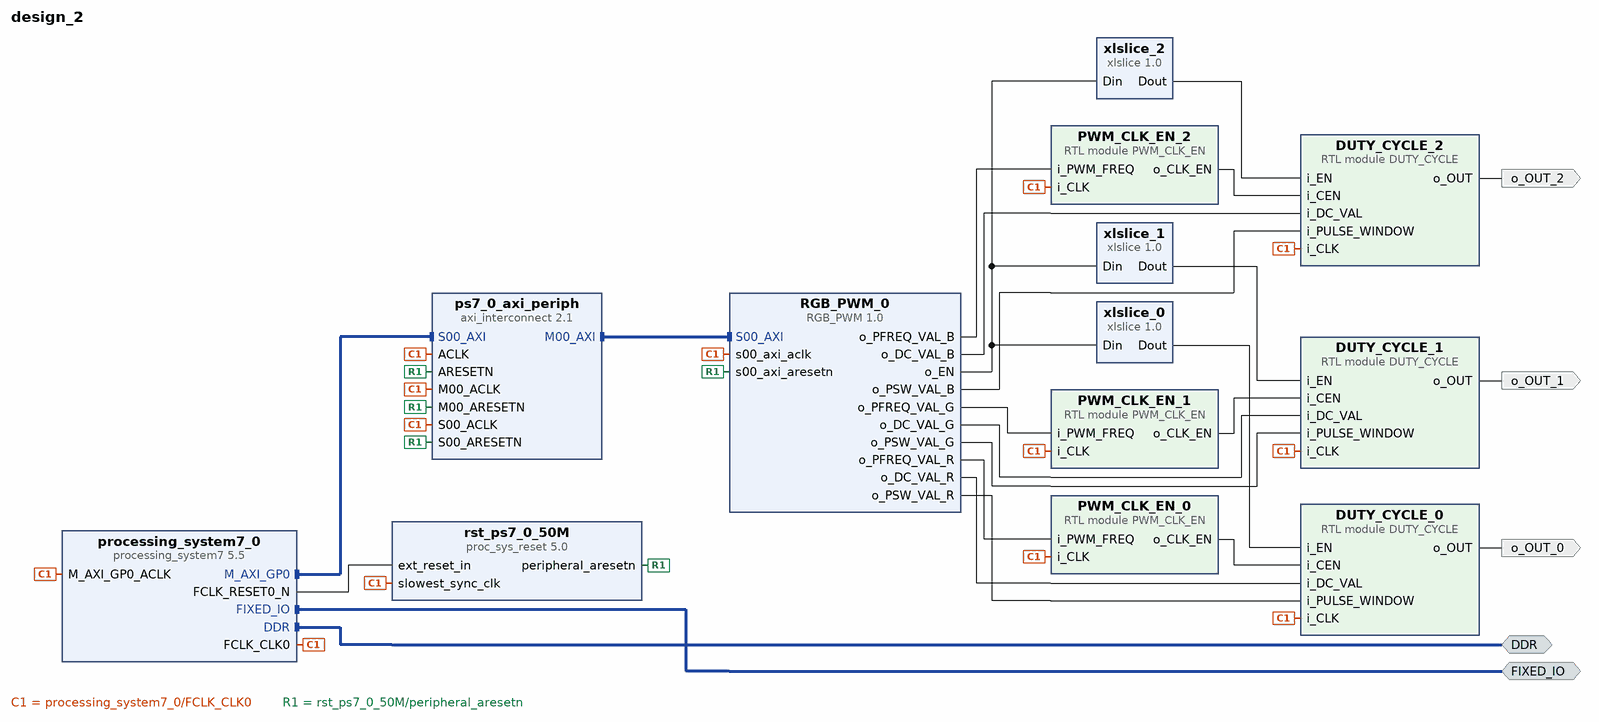
[diagram p0: block diagram of the top level]
# Vivado block design design_2, xc7z007sclg400-1, Vivado 2019.1
create_bd_design design_2

create_bd_intf_port -mode Master -vlnv xilinx.com:interface:ddrx_rtl:1.0 DDR
create_bd_intf_port -mode Master -vlnv xilinx.com:display_processing_system7:fixedio_rtl:1.0 FIXED_IO
create_bd_port -dir O o_OUT_2
create_bd_port -dir O o_OUT_0
create_bd_port -dir O o_OUT_1

create_bd_cell -type ip -vlnv xilinx.com:ip:processing_system7:5.5 processing_system7_0
set_property -dict [list \
  CONFIG.PCW_FPGA0_PERIPHERAL_FREQMHZ 50 \
  CONFIG.PCW_GPIO_MIO_GPIO_ENABLE 1 \
  CONFIG.PCW_GPIO_MIO_GPIO_IO MIO \
  CONFIG.PCW_I2C_RESET_ENABLE 1 \
  CONFIG.PCW_QSPI_GRP_FBCLK_ENABLE 1 \
  CONFIG.PCW_QSPI_GRP_FBCLK_IO {MIO 8} \
  CONFIG.PCW_QSPI_GRP_SINGLE_SS_ENABLE 1 \
  CONFIG.PCW_QSPI_GRP_SINGLE_SS_IO {MIO 1 .. 6} \
  CONFIG.PCW_QSPI_PERIPHERAL_ENABLE 1 \
  CONFIG.PCW_QSPI_QSPI_IO {MIO 1 .. 6} \
  CONFIG.PCW_SD0_GRP_CD_ENABLE 1 \
  CONFIG.PCW_SD0_GRP_CD_IO {MIO 47} \
  CONFIG.PCW_SD0_GRP_WP_ENABLE 0 \
  CONFIG.PCW_SD0_PERIPHERAL_ENABLE 1 \
  CONFIG.PCW_SD0_SD0_IO {MIO 40 .. 45} \
  CONFIG.PCW_SDIO_PERIPHERAL_FREQMHZ 100 \
  CONFIG.PCW_SINGLE_QSPI_DATA_MODE x4 \
  CONFIG.PCW_SPI1_PERIPHERAL_ENABLE 1 \
  CONFIG.PCW_SPI1_SPI1_IO {MIO 10 .. 15} \
  CONFIG.PCW_UART0_PERIPHERAL_ENABLE 1 \
  CONFIG.PCW_UART0_UART0_IO {MIO 14 .. 15} \
  CONFIG.PCW_UART1_PERIPHERAL_ENABLE 0 \
  CONFIG.PCW_UART_PERIPHERAL_FREQMHZ 100 \
  CONFIG.PCW_UIPARAM_DDR_BUS_WIDTH {16 Bit} \
  CONFIG.PCW_UIPARAM_DDR_MEMORY_TYPE {DDR 3 (Low Voltage)} \
  CONFIG.PCW_UIPARAM_DDR_PARTNO Custom \
  CONFIG.PCW_USB0_PERIPHERAL_ENABLE 1 \
  CONFIG.PCW_USB0_RESET_ENABLE 1 \
  CONFIG.PCW_USB0_RESET_IO {MIO 46} \
  CONFIG.PCW_USB0_USB0_IO {MIO 28 .. 39} \
  CONFIG.PCW_USB_RESET_ENABLE 1 \
  CONFIG.PCW_USB_RESET_SELECT {Share reset pin} \
] [get_bd_cells processing_system7_0]
# 222 more settings of processing_system7_0 are not shown: defaults, MIO pin electricals, DDR timing, and values the tool derives
create_bd_cell -type ip -vlnv xilinx.com:ip:axi_interconnect:2.1 ps7_0_axi_periph
set_property -dict {CONFIG.NUM_MI 1} [get_bd_cells ps7_0_axi_periph]
create_bd_cell -type ip -vlnv xilinx.com:ip:proc_sys_reset:5.0 rst_ps7_0_50M
create_bd_cell -type ip -vlnv user.org:user:RGB_PWM:1.0 RGB_PWM_0
create_bd_cell -type module -reference PWM_CLK_EN PWM_CLK_EN_0
create_bd_cell -type module -reference PWM_CLK_EN PWM_CLK_EN_1
create_bd_cell -type module -reference PWM_CLK_EN PWM_CLK_EN_2
create_bd_cell -type module -reference DUTY_CYCLE DUTY_CYCLE_0
create_bd_cell -type module -reference DUTY_CYCLE DUTY_CYCLE_1
create_bd_cell -type module -reference DUTY_CYCLE DUTY_CYCLE_2
create_bd_cell -type ip -vlnv xilinx.com:ip:xlslice:1.0 xlslice_0
set_property -dict {CONFIG.DIN_FROM 0 CONFIG.DIN_TO 0 CONFIG.DIN_WIDTH 3} [get_bd_cells xlslice_0]
create_bd_cell -type ip -vlnv xilinx.com:ip:xlslice:1.0 xlslice_1
set_property -dict {CONFIG.DIN_FROM 1 CONFIG.DIN_TO 1 CONFIG.DIN_WIDTH 3 CONFIG.DOUT_WIDTH 1} [get_bd_cells xlslice_1]
create_bd_cell -type ip -vlnv xilinx.com:ip:xlslice:1.0 xlslice_2
set_property -dict {CONFIG.DIN_FROM 2 CONFIG.DIN_TO 2 CONFIG.DIN_WIDTH 3 CONFIG.DOUT_WIDTH 1} [get_bd_cells xlslice_2]

# ---- connections ----

connect_bd_intf_net [get_bd_intf_ports FIXED_IO] [get_bd_intf_pins processing_system7_0/FIXED_IO]
connect_bd_intf_net [get_bd_intf_ports DDR] [get_bd_intf_pins processing_system7_0/DDR]
connect_bd_intf_net [get_bd_intf_pins processing_system7_0/M_AXI_GP0] [get_bd_intf_pins ps7_0_axi_periph/S00_AXI]
connect_bd_intf_net [get_bd_intf_pins ps7_0_axi_periph/M00_AXI] [get_bd_intf_pins RGB_PWM_0/S00_AXI]
connect_bd_net [get_bd_pins processing_system7_0/FCLK_CLK0] \
  [get_bd_pins processing_system7_0/M_AXI_GP0_ACLK] [get_bd_pins ps7_0_axi_periph/S00_ACLK] \
  [get_bd_pins rst_ps7_0_50M/slowest_sync_clk] [get_bd_pins ps7_0_axi_periph/M00_ACLK] [get_bd_pins ps7_0_axi_periph/ACLK] \
  [get_bd_pins RGB_PWM_0/s00_axi_aclk] [get_bd_pins PWM_CLK_EN_0/i_CLK] [get_bd_pins PWM_CLK_EN_1/i_CLK] \
  [get_bd_pins PWM_CLK_EN_2/i_CLK] [get_bd_pins DUTY_CYCLE_0/i_CLK] [get_bd_pins DUTY_CYCLE_1/i_CLK] \
  [get_bd_pins DUTY_CYCLE_2/i_CLK]
connect_bd_net [get_bd_pins processing_system7_0/FCLK_RESET0_N] [get_bd_pins rst_ps7_0_50M/ext_reset_in]
connect_bd_net [get_bd_pins rst_ps7_0_50M/peripheral_aresetn] \
  [get_bd_pins ps7_0_axi_periph/S00_ARESETN] [get_bd_pins ps7_0_axi_periph/M00_ARESETN] \
  [get_bd_pins ps7_0_axi_periph/ARESETN] [get_bd_pins RGB_PWM_0/s00_axi_aresetn]
connect_bd_net [get_bd_pins RGB_PWM_0/o_PFREQ_VAL_R] [get_bd_pins PWM_CLK_EN_0/i_PWM_FREQ]
connect_bd_net [get_bd_pins RGB_PWM_0/o_PFREQ_VAL_G] [get_bd_pins PWM_CLK_EN_1/i_PWM_FREQ]
connect_bd_net [get_bd_pins RGB_PWM_0/o_PFREQ_VAL_B] [get_bd_pins PWM_CLK_EN_2/i_PWM_FREQ]
connect_bd_net [get_bd_pins RGB_PWM_0/o_DC_VAL_R] [get_bd_pins DUTY_CYCLE_0/i_DC_VAL]
connect_bd_net [get_bd_pins RGB_PWM_0/o_PSW_VAL_R] [get_bd_pins DUTY_CYCLE_0/i_PULSE_WINDOW]
connect_bd_net [get_bd_pins RGB_PWM_0/o_DC_VAL_G] [get_bd_pins DUTY_CYCLE_1/i_DC_VAL]
connect_bd_net [get_bd_pins RGB_PWM_0/o_PSW_VAL_G] [get_bd_pins DUTY_CYCLE_1/i_PULSE_WINDOW]
connect_bd_net [get_bd_pins RGB_PWM_0/o_DC_VAL_B] [get_bd_pins DUTY_CYCLE_2/i_DC_VAL]
connect_bd_net [get_bd_pins RGB_PWM_0/o_PSW_VAL_B] [get_bd_pins DUTY_CYCLE_2/i_PULSE_WINDOW]
connect_bd_net [get_bd_pins PWM_CLK_EN_0/o_CLK_EN] [get_bd_pins DUTY_CYCLE_0/i_CEN]
connect_bd_net [get_bd_pins PWM_CLK_EN_1/o_CLK_EN] [get_bd_pins DUTY_CYCLE_1/i_CEN]
connect_bd_net [get_bd_pins PWM_CLK_EN_2/o_CLK_EN] [get_bd_pins DUTY_CYCLE_2/i_CEN]
connect_bd_net [get_bd_pins RGB_PWM_0/o_EN] [get_bd_pins xlslice_0/Din] [get_bd_pins xlslice_1/Din] [get_bd_pins xlslice_2/Din]
connect_bd_net [get_bd_pins xlslice_0/Dout] [get_bd_pins DUTY_CYCLE_0/i_EN]
connect_bd_net [get_bd_pins xlslice_1/Dout] [get_bd_pins DUTY_CYCLE_1/i_EN]
connect_bd_net [get_bd_pins xlslice_2/Dout] [get_bd_pins DUTY_CYCLE_2/i_EN]
connect_bd_net [get_bd_pins DUTY_CYCLE_2/o_OUT] [get_bd_ports o_OUT_2]
connect_bd_net [get_bd_pins DUTY_CYCLE_0/o_OUT] [get_bd_ports o_OUT_0]
connect_bd_net [get_bd_pins DUTY_CYCLE_1/o_OUT] [get_bd_ports o_OUT_1]

# ---- address map ----
assign_bd_address -offset 0x4BB04000 -range 4K -target_address_space [get_bd_addr_spaces processing_system7_0/Data] [get_bd_addr_segs RGB_PWM_0/S00_AXI/S00_AXI_reg]

validate_bd_design
save_bd_design
